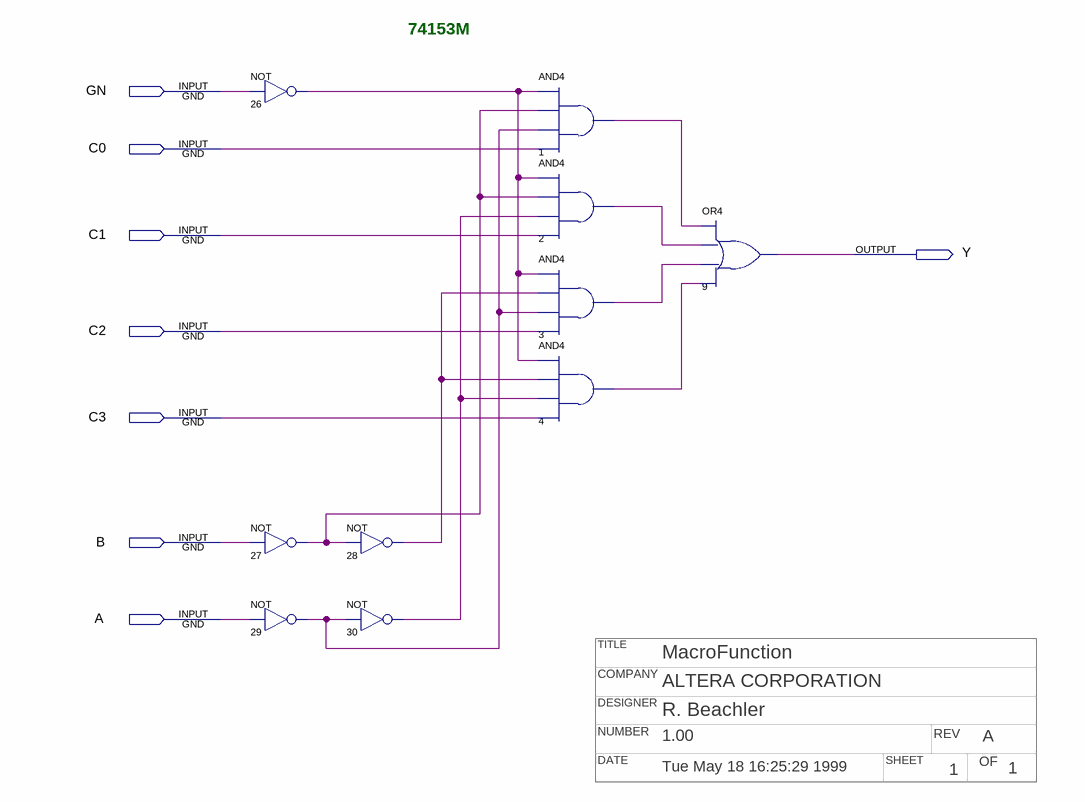
[diagram p0: schematic sheet]
// Quartus schematic 74153m.bdf as structural Verilog: 10 symbols, 8 pins
// Title block: TITLE: MacroFunction; COMPANY: ALTERA CORPORATION; DESIGNER: R. Beachler; NUMBER: 1.00; REV: A; DATE: Tue May 18 16:25:29 1999; SHEET: 1; OF: 1
module \74153m  (
  input  GN,
  input  C0,
  input  C1,
  input  C2,
  input  C3,
  input  B,
  input  A,
  output Y
);

  wire n1_out, n2_out, n3_out, n4_out, n26_out, n27_out, n28_out, n29_out, n30_out;

  not u_26 (n26_out, GN);
  not u_27 (n27_out, B);
  not u_29 (n29_out, A);
  not u_28 (n28_out, n27_out);
  not u_30 (n30_out, n29_out);
  and u_1 (n1_out, n26_out, n27_out, n29_out, C0);
  and u_2 (n2_out, n26_out, n27_out, n30_out, C1);
  and u_3 (n3_out, n26_out, n28_out, n29_out, C2);
  and u_4 (n4_out, n26_out, n28_out, n30_out, C3);
  or u_9 (Y, n1_out, n2_out, n3_out, n4_out);

  // Notes on the sheet:
  //   74153M
endmodule
